# EAGLE design Adafruit AW9523 (EAGLE 9.6.2)
COMPANY: ADAFRUIT INDUSTRIES; DRAWN: KTOWN; REV: A
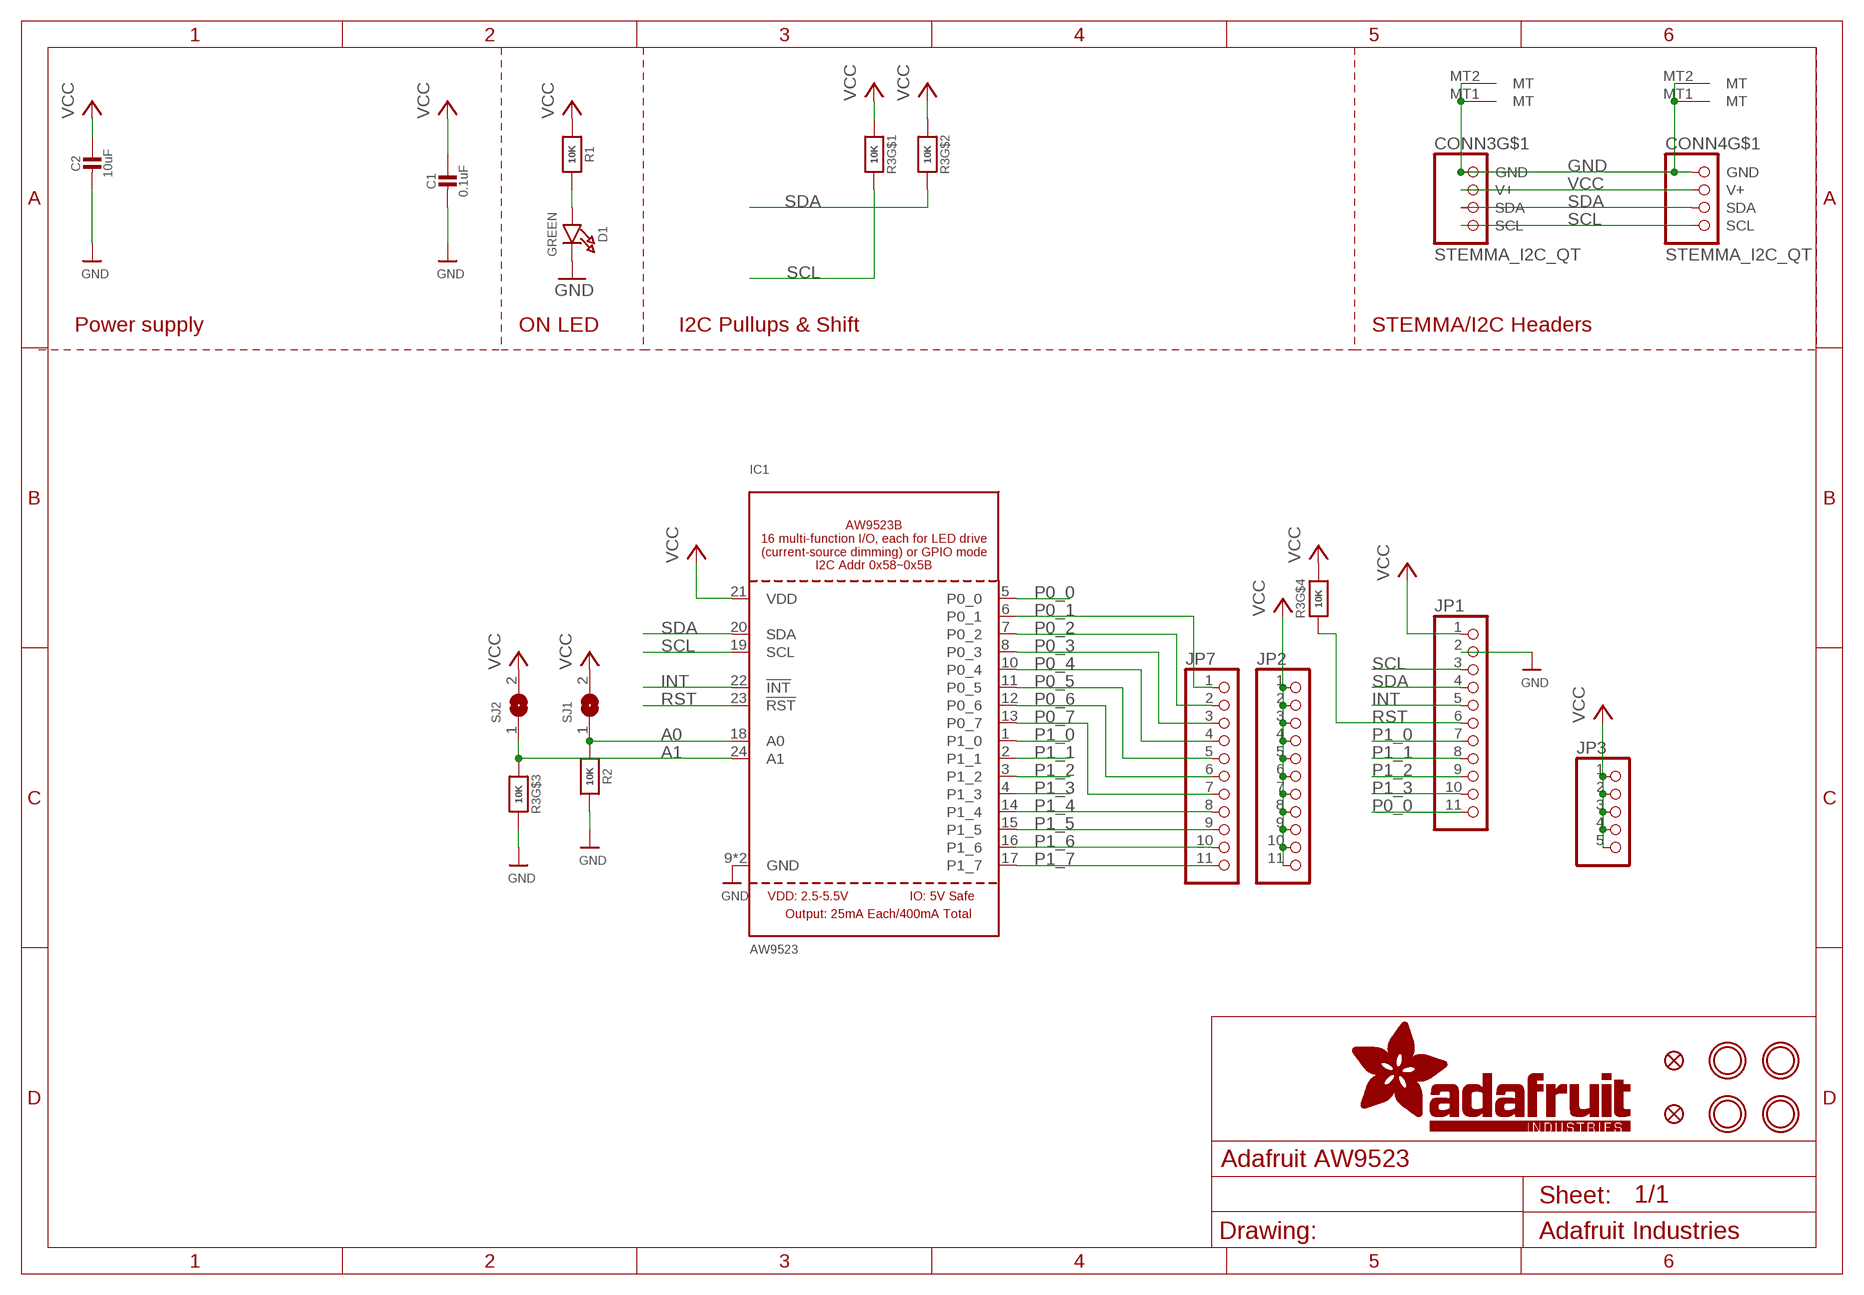
[diagram p0: schematic, sheet 1]

## Parts
C1  0.1uF  CAP_CERAMIC0603_NO  [0603-NO]
C2  10uF  CAP_CERAMIC0805-NOOUTLINE  [0805-NO]
CONN3  STEMMA_I2C_QT  [JST_SH4]
CONN4  STEMMA_I2C_QT  [JST_SH4]
D1  GREEN  LED0603_NOOUTLINE  [CHIPLED_0603_NOOUTLINE]
FID3  FIDUCIAL_1MM  [FIDUCIAL_1MM]
FID4  FIDUCIAL_1MM  [FIDUCIAL_1MM]
IC1  AW9523  [QFN24_4MM_SMSC]
JP1  HEADER-1X11  [1X11_ROUND]
JP2  HEADER-1X11  [1X11_ROUND]
JP3  HEADER-1X5ROUND  [1X05_ROUND]
JP7  HEADER-1X11  [1X11_ROUND]
R1  10K  RESISTOR_0603_NOOUT  [0603-NO]
R2  10K  RESISTOR_0603_NOOUT  [0603-NO]
R3  10K  RESISTOR_4PACK  [RESPACK_4X0603]
SJ1  SOLDERJUMPER  [SOLDERJUMPER_ARROW_NOPASTE]
SJ2  SOLDERJUMPER  [SOLDERJUMPER_ARROW_NOPASTE]
U$1  MOUNTINGHOLE2.5  [MOUNTINGHOLE_2.5_PLATED]
U$17  MOUNTINGHOLE2.5  [MOUNTINGHOLE_2.5_PLATED]
U$19  MOUNTINGHOLE2.5  [MOUNTINGHOLE_2.5_PLATED]
U$21  MOUNTINGHOLE2.5  [MOUNTINGHOLE_2.5_PLATED]

## Nets
A0: IC1.18(A0) R2.1 SJ1.1
A1: IC1.24(A1) R3.3 SJ2.1
GND [highpower]: C1.2 C2.2 CONN3.1(GND) CONN3.MT1(MT) CONN3.MT2(MT) CONN4.1(GND) CONN4.MT1(MT) CONN4.MT2(MT) D1.C IC1.9(GND) IC1.THERM(GND) JP1.2 R2.2 R3.6
INT: IC1.22(!INT) JP1.5
N$1: D1.A R1.2
P0_0: IC1.5(P0_0) JP1.11
P0_1: IC1.6(P0_1) JP7.1
P0_2: IC1.7(P0_2) JP7.2
P0_3: IC1.8(P0_3) JP7.3
P0_4: IC1.10(P0_4) JP7.4
P0_5: IC1.11(P0_5) JP7.5
P0_6: IC1.12(P0_6) JP7.6
P0_7: IC1.13(P0_7) JP7.7
P1_0: IC1.1(P1_0) JP1.7
P1_1: IC1.2(P1_1) JP1.8
P1_2: IC1.3(P1_2) JP1.9
P1_3: IC1.4(P1_3) JP1.10
P1_4: IC1.14(P1_4) JP7.8
P1_5: IC1.15(P1_5) JP7.9
P1_6: IC1.16(P1_6) JP7.10
P1_7: IC1.17(P1_7) JP7.11
RST: IC1.23(!RST) JP1.6 R3.4
SCL: CONN3.4(SCL) CONN4.4(SCL) IC1.19(SCL) JP1.3 R3.8
SDA: CONN3.3(SDA) CONN4.3(SDA) IC1.20(SDA) JP1.4 R3.7
VCC [highpower]: C1.1 C2.1 CONN3.2(V+) CONN4.2(V+) IC1.21(VDD) JP1.1 JP2.1 JP2.2 JP2.3 JP2.4 JP2.5 JP2.6 JP2.7 JP2.8 JP2.9 JP2.10 JP2.11 JP3.1 JP3.2 JP3.3 JP3.4 JP3.5 R1.1 R3.1 R3.2 R3.5 SJ1.2 SJ2.2

## Notes on the sheet
- Power supply | ON LED | I2C Pullups & Shift | STEMMA/I2C Headers

## Library data of the parts
C1 C2 = microbuilder:CAP_CERAMIC: Ceramic Capacitors For new designs, use the packages preceded by an '_' character since they are more reliable: The following footprints should be used on most boards: _0402 - Standard footprint for regular board layouts _0603 - Standard footprint for regular board layouts _0805 - Standard footprint for regular board layouts _1206 - Standard footprint for regular board layouts For extremely tight-pitch boards where space is at a premium, the following 'micro-pitch' footprints can be used (smaller pads, no silkscreen outline, etc.): _0402MP - Micro-pitch footprint for very dense/compact boards _0603MP - Micro-pitch footprint for very dense/compact boards _0805MP - Micro-pitch footprint for very dense/compact boards _1206MP - Micro-pitch footprint for very dense/compact boards
CONN3 CONN4 = microbuilder:STEMMA_I2C
D1 = microbuilder:LED: LED 0603 - 0603 Surface Mount Package 2mA: Green LED - Low Power (3.9mcd, 2ma, 1.7Vf) - Digikey: 475-2709-2-ND Orange LED - Low Power (9.8mcd, 2ma, 1.8Vf) - Digikey: 475-1194-2-ND Red LED - Low Power (5mcd, 2ma, 1.8Vf) - Digikey: 475-1195-2-ND Yellow LED - Low Power (7mcd, 2ma, 1.8Vf) - Digikey: 475-1196-2-ND 5mA: Blue LED - Low Power (17mcd, 5ma, 2.9Vf) - Digikey: LNJ937W8CRACT-ND 0805 - 0805 Surface Mount Package 2mA: Red LED (8.8mcd, 2mA, 1.8Vf, Clear) - Low Power [Digikey: 475-2510-1-ND] Green LED (5mcd, 2mA, 1.8Vf, Clear) - Low Power [Digikey: 475-2730-1-ND] Yellow LED (11.3mcd, 2mA, 1.8Vf, Clear) - Low Power [Digikey: 475-2555-1-ND] 20mA: Red LED (104mcd, 20mA, Diffused) - LS R976 [Digikey: 475-1278-6-ND] Red LED (12mcd, 20mA, 2.0Vf, Clear) - APT2012EC [Digikey: 754-1128-1-ND] Green LED (15mcd, 20mA, 2.2Vf, Clear) - APT2012GC [Digikey: 754-1131-1-ND] Orange LED (160mcd, 20mA, 2.1Vf, Clear) - APT2012SECK [Digikey: 754-1130-1-ND] 1206 - 1206 Surface Mount Package Green LED (26mcd, 20mA, Diffused) - LG N971 [Digikey: 475-1407-6-ND] Red LED (15mcd, 20mA, Diffused) - LH N974 [Digikey: 475-1416-6-ND] Cree - Cree High-Power Surface Mount LEDs XPEBWT-L1-0000-00D50 - White 111lm 350mA 2.9Vf 6200K 110° XTEAWT-00-0000-00000LEE3 - White 114lm 350mA 2.85Vf 5000K 115° Everlight - Everlight 45-21 Series Surface Mount LEDs 45-21/QK2C-B2832AC2CB2/2T - Warm White 2000mcd 20mA 3.25Vf 3050K 120° 45-21/LK2C-B38452C4CB2/2T - Nuetral White 2000mcd 20mA 3.25Vf 4150K 120° 45-21/LK2C-B50634C6CB2/2T - Cold White 2200mcd 20mA 3.25Vf 5650K 120° PLCC2 Reverse Mount LS T77K-J1L2-1-0-2-R18-Z - Red 11.25mcd 2mA 1.8Vf 630nm 120° LO T77K-L1M2-24-Z - Orange 19.6mcd 2mA 1.8Vf 606nm 120° LY T77K-K2M1-26-Z - Yellow 15.7mcd 2mA 1.8Vf 587nm 120°
FID3 FID4 = microbuilder:FIDUCIAL: Fiducial Alignment Points Various fiducial points for machine vision alignment.; BOM: EXCLUDE
IC1 = microbuilder:AW9523
JP1 JP2 JP7 = microbuilder:HEADER-1X11
JP3 = microbuilder:HEADER-1X5: PIN HEADER
R1 R2 = microbuilder:RESISTOR: Resistors For new designs, use the packages preceded by an '_' character since they are more reliable: The following footprints should be used on most boards: _0402 - Standard footprint for regular board layouts _0603 - Standard footprint for regular board layouts _0805 - Standard footprint for regular board layouts _1206 - Standard footprint for regular board layouts For extremely tight-pitch boards where space is at a premium, the following 'micro-pitch' footprints can be used (smaller pads, no silkscreen outline, etc.): _0402MP - Micro-pitch footprint for very dense/compact boards _0603MP - Micro-pitch footprint for very dense/compact boards _0805MP - Micro-pitch footprint for very dense/compact boards _1206MP - Micro-pitch footprint for very dense/compact boards
R3 = microbuilder:RESISTOR_4PACK: Resistor Packs (4 resistors) 4 x 0603 10K 1/16W - Digikey: YC164J-10KCT-ND
SJ1 SJ2 = microbuilder:SOLDERJUMPER: SMD Solder JUMPER Solder the two pads together to create a connection, or remove the solder to break it. REFLOW - Use this footprint for solder paste and reflow ovens. WAVE - Use this footprint for hand-soldering (larger pads). CLOSED - Has a trace between the two pads to ensure it is closed by default. The trace needs to be cut to disable the jumper, and can be closed again by creating a solder bridge between the two pads.; BOM: EXCLUDE
U$1 U$17 U$19 U$21 = microbuilder:MOUNTINGHOLE: Mounting Hole For #2 screws (0.086"/2.18mm width, 0.094"/2.4mm hole) use 2.5mm; BOM: EXCLUDE

## Net classes
1 highpower: width 0.305 mm, drill 0.483 mm
2 lowpower: width 0.254 mm, drill 0.483 mm

## Board
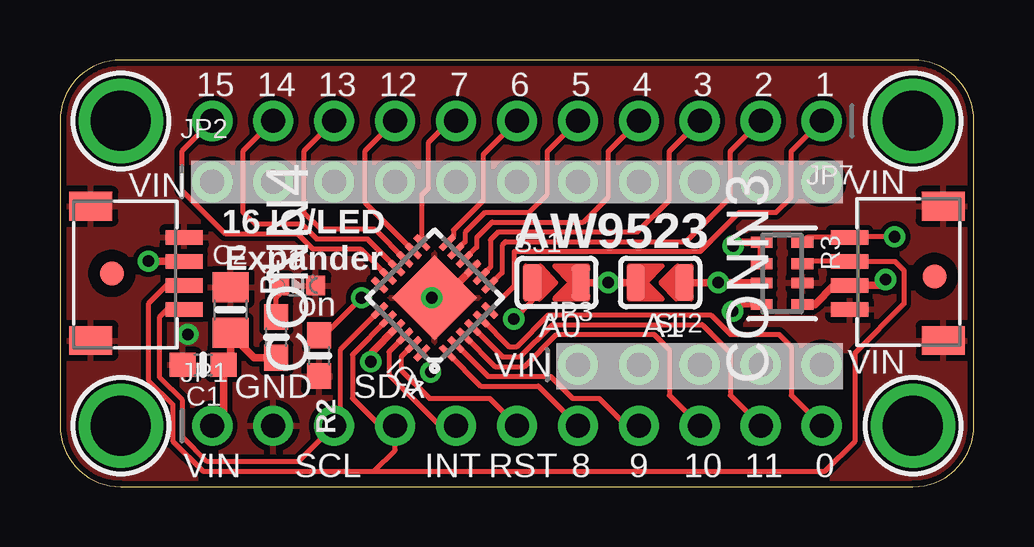
[diagram p1: board, top side]
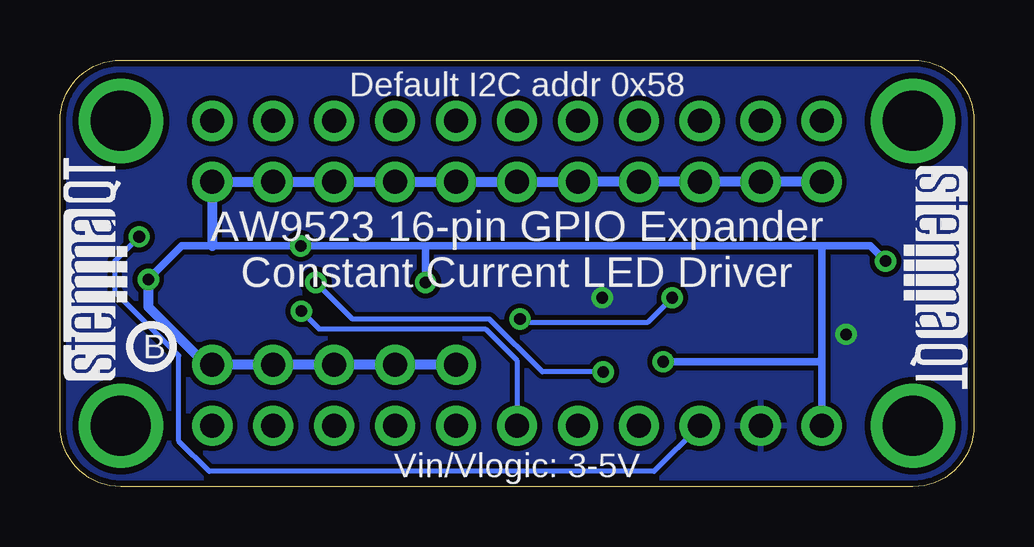
[diagram p2: board, bottom side, seen from below]

Size 38.1 x 17.78 mm. Coordinates in mm from the lower left corner, seen from the top.
Outline: 0,15.24 0,2.54 arc90 2.54,0 35.56,0 arc90 38.1,2.54 38.1,15.24 arc90 35.56,17.78 2.54,17.78 arc90 0,15.24
Copper layers (1*16): Top 0.035mm / dielectric 1.5mm / Bottom 0.035mm
Design rules "adafruit *": minimum track width 8mil, minimum drill 15.5mil, track to track 8mil, track to pad 8mil, pad to pad 8mil, via to via 8mil, smd to smd 8mil, copper to edge 10mil, drill to drill 8mil, minimum pad ring 10mil, minimum via ring 8mil, stop-mask expansion 2mil, vias tented up to drill 20mil, thermal gap 10mil

### Footprints (pad centres in the part's own frame; a part is rotated, then mirrored left to right if it is on the bottom)
0603-NO = smd 1.075 x 1: 1 -0.85,0; 2 0.85,0
0805-NO = smd 1.24 x 1.5: 1 -0.95,0; 2 0.95,0
JST_SH4 = smd 0.6 x 1.55: 1 -1.5,2.514; 2 -0.5,2.514; 3 0.5,2.514; 4 1.5,2.514 | smd 1.2 x 1.8: MT1 -2.8,-1.386; MT2 2.8,-1.386
CHIPLED_0603_NOOUTLINE = smd 0.8 x 0.8: A 0,-0.75; C 0,0.75
FIDUCIAL_1MM = smd 1 x 1: 1 0,0
QFN24_4MM_SMSC = smd 0.8 x 0.28: 1 -2,1.25; 2 -2,0.75; 3 -2,0.25; 4 -2,-0.25; 5 -2,-0.75; 6 -2,-1.25; 13 2,-1.25; 14 2,-0.75; 15 2,-0.25; 16 2,0.25; 17 2,0.75; 18 2,1.25 | smd 0.28 x 0.8: 7 -1.25,-2; 8 -0.75,-2; 9 -0.25,-2; 10 0.25,-2; 11 0.75,-2; 12 1.25,-2; 19 1.25,2; 20 0.75,2; 21 0.25,2; 22 -0.25,2; 23 -0.75,2; 24 -1.25,2 | smd 2.5 x 2.5: THERM 0,0
1X11_ROUND = drill 1 pad 1.676: 1 -12.7,0; 2 -10.16,0; 3 -7.62,0; 4 -5.08,0; 5 -2.54,0; 6 0,0; 7 2.54,0; 8 5.08,0; 9 7.62,0; 10 10.16,0; 11 12.7,0
1X05_ROUND = drill 1 pad 1.676: 1 -5.08,0; 2 -2.54,0; 3 0,0; 4 2.54,0; 5 5.08,0
RESPACK_4X0603 = smd 0.45 x 0.9: 1 -1.3,-0.85; 2 -0.4,-0.85; 3 0.4,-0.85; 4 1.3,-0.85; 5 1.3,0.85; 6 0.4,0.85; 7 -0.4,0.85; 8 -1.3,0.85
SOLDERJUMPER_ARROW_NOPASTE = smd 0.762 x 1.524: 1 -1.016,0; 2 1.016,0
MOUNTINGHOLE_2.5_PLATED = drill 2.5 pad 3.2: P$1 0,0

### Placement (x,y rotation side)
C1  5.97,5.08 180 top
C2  7.11,7.37 90 top
CONN3  35.43,8.89 90 top
CONN4  2.67,8.89 270 top
D1  9.91,8.38 270 top
FID3  2.16,8.89 0 top
FID4  36.45,8.76 0 top
IC1  15.62,7.87 135 top
JP1  19.05,2.54 0 top
JP2  19.05,12.7 0 top
JP3  26.67,5.08 0 top
JP7  19.05,15.24 180 top
R1  9.02,6.22 90 top
R2  10.79,5.46 270 top
R3  30.1,8.89 270 top
SJ1  20.7,8.51 0 top
SJ2  25.02,8.51 180 top
U$1  2.54,15.24 0 top
U$2  [PCBFEAT-REV-040]  34.29,5.84 0 bottom
U$17  35.56,15.24 0 top
U$19  2.54,2.54 0 top
U$21  35.56,2.54 0 top
U$30  [STEMMAQT]  35.31,4.45 90 bottom
U$31  [STEMMAQT]  2.92,13.34 270 bottom

### Tracks (layer width: path | path; a pad name or v marks a point on that pad's centre or on a via)
A0  (via drill 0.48)
  Top 0.203: SJ1.1 19.68,7.75 v18.92,6.99 | IC1.18 12.79,7.87 v12.57,7.87 11.01,6.31 R2.1
  Bottom 0.203: v12.57,7.87 13.59,6.86 18.8,6.86 v18.92,6.99
A1  (via drill 0.48)
  Top 0.203: IC1.24 15.45,5.22 v15.45,4.78
  Top 0.305: SJ2.1 v27.43,8.51 29.23,8.51 R3.3
  Bottom 0.203: v15.45,4.78 17.99,4.78 20.19,6.99 25.91,6.99 v27.43,8.51
GND  (via drill 0.48)
  Top 0.305: IC1.9 15.97,7.87 IC1.THERM v15.49,7.87
  other vias: 5.33,6.35
  pour Top: 0,17.78 38.1,17.78 38.1,0 0,0
  pour Bottom: 0,17.78 38.1,17.78 38.1,0 0,0
INT
  Top 0.203: IC1.22 13.72,5.62 13.72,4.66 15.84,2.54 JP1.5
N$1
  Top 0.203: D1.A 9.16,8 9.02,7.87 R1.2
P0_0
  Top 0.203: IC1.5 18.71,5.84 19.04,5.84 20.36,7.16 27.13,7.16 27.94,6.35 29.97,6.35 30.48,5.84 30.48,3.81 JP1.11
P0_1
  Top 0.203: IC1.6 18.93,8.36 18.93,9.8 26.7,9.8 28.32,11.43 29.84,11.43 30.48,12.06 30.48,13.97 JP7.1
P0_2
  Top 0.203: IC1.7 18.43,8.91 18.43,10.05 18.58,10.21 26.09,10.21 27.94,12.06 27.94,13.97 JP7.2
P0_3
  Top 0.203: IC1.8 17.95,9.14 17.95,10.28 18.28,10.62 24.08,10.62 25.4,11.94 25.4,13.97 JP7.3
P0_4
  Top 0.203: IC1.10 17.37,9.97 17.37,10.38 18.02,11.02 21.82,11.02 22.86,12.06 22.86,13.97 JP7.4
P0_5
  Top 0.203: IC1.11 16.89,10.2 16.89,10.6 17.72,11.43 19.56,11.43 20.32,12.19 20.32,13.97 JP7.5
P0_6
  Top 0.203: IC1.12 16.41,10.43 16.41,10.69 17.65,11.94 17.65,13.84 JP7.6
P0_7
  Top 0.203: IC1.13 15.09,12.17 15.37,12.45 15.37,14.35 16.26,15.24 JP7.7
P1_0
  Top 0.203: IC1.1 17.54,4.19 19.94,4.19 JP1.7
P1_1
  Top 0.203: IC1.2 17.84,4.6 20.46,4.6 21.37,3.68 22.48,3.68 23.62,2.54 JP1.8
P1_2
  Top 0.203: IC1.3 18.14,5 19.36,5 20.7,6.35 24.77,6.35 25.4,5.71 25.4,3.81 JP1.9
P1_3
  Top 0.203: IC1.4 18.44,5.41 19.19,5.41 20.53,6.76 26.77,6.76 27.94,5.59 27.94,3.81 JP1.10
P1_4
  Top 0.203: JP7.8 12.7,13.97 12.7,11.86 IC1.14
P1_5
  Top 0.203: JP7.9 10.16,13.97 10.16,11.44 10.88,10.72 13.13,10.72 IC1.15
P1_6
  Top 0.203: IC1.16 12.83,10.31 10.71,10.31 10.07,10.95 8.13,10.95 7.62,11.46 7.62,13.97 JP7.10
P1_7
  Top 0.203: JP7.11 5.08,13.97 5.08,12.35 6.89,10.54 9.91,10.54 10.54,9.91 12.53,9.91 IC1.17
RST  (via drill 0.48)
  Top 0.203: IC1.23 14.22,5.42 14.22,4.86 15.4,3.68 17.91,3.68 JP1.6 | v28.04,7.31 28.31,7.59 R3.4
  Bottom 0.203: v28.04,7.31 27.3,6.58 20.36,6.58 19.05,5.27 JP1.6
SCL  (via drill 0.48)
  Top 0.203: IC1.19 11.68,5.71 11.68,2.79 JP1.3 9.93,1.04 6.14,1.04 5.11,2.07 5.11,3.6 4.16,4.54 4.16,7.08 4.47,7.39 CONN4.4 | v34.8,10.41 32.94,10.41 CONN3.4 31.15,10.39 R3.8
  Bottom 0.203: JP1.3 13.34,0.64 31.88,0.64 33.15,1.91 33.15,5.46 35.81,8.13 35.81,9.4 v34.8,10.41
SDA
  Top 0.203: IC1.20 12.19,5.51 12.19,3.68 13.34,2.54 JP1.4 13.97,1.52 13.08,0.64 | CONN4.3 4.45,8.39 3.68,7.62 3.68,4.45 4.7,3.43 4.7,1.91 5.97,0.64 13.08,0.64 | 13.08,0.64 31.88,0.64 33.15,1.91 33.15,5.59 35.18,7.62 35.18,9.02 34.81,9.39 CONN3.3 31.05,9.39 R3.7
VCC  (via drill 0.48)
  Top 0.305: IC1.21 13.01,5.61 13.01,5.26 v12.95,5.21 | v34.42,8.64 34.17,8.39 CONN3.2 32.27,8.39 31.47,7.59 R3.5 | SJ1.2 v22.86,8.51 SJ2.2 | R3.2 R3.1 28.22,10.19 v28.07,10.03 | v3.68,9.4 3.69,9.39 CONN4.2 | C2.1 7.11,6.35 | 7.11,6.35 7.11,5.37 C1.1 6.82,3.01 JP1.1 | R1.1 8.09,5.37 7.11,6.35
  Bottom 0.305: v34.42,8.64 33.02,10.03 31.75,10.03 v28.07,10.03 22.86,10.03 | v22.86,8.51 22.86,10.03 | 22.86,10.03 6.35,10.03 | 6.35,10.03 4.32,10.03 v3.68,9.4 | 6.35,10.03 6.35,5.33 | 6.35,5.33 JP1.1 | 6.35,5.33 6.48,5.21 v12.95,5.21
  Bottom 0.406: JP3.1 JP3.2 JP3.3 JP3.4 JP3.5 32,5.08 34.42,7.49 v34.42,8.64 | JP2.1 JP2.2 JP2.3 JP2.4 JP2.5 JP2.6 JP2.7 JP2.8 JP2.9 JP2.10 JP2.11 31.75,10.03

### Text on the board
tPlace: 15 | 14 | 13 | 12 | 7 | 6 | 5 | 4 | 3 | 2 | 1 | VIN | VIN | AW9523 | 16 IO/LED / Expander | on | A0 | A1 | VIN | VIN | GND | SDA | VIN | SCL | INT | RST | 8 | 9 | 10 | 11 | 0
bPlace: Default I2C addr 0x58 | AW9523 16-pin GPIO Expander / Constant Current LED Driver | Vin/Vlogic: 3-5V